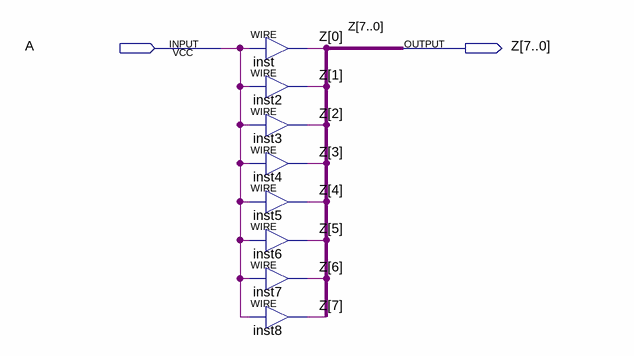
[diagram p0: schematic sheet]
// Quartus schematic replicate.bdf as structural Verilog: 8 symbols, 2 pins
module replicate (
  input  A,
  output [7:0] Z
);

  assign Z[0] = A;  // WIRE inst
  assign Z[1] = A;  // WIRE inst2
  assign Z[2] = A;  // WIRE inst3
  assign Z[3] = A;  // WIRE inst4
  assign Z[4] = A;  // WIRE inst5
  assign Z[5] = A;  // WIRE inst6
  assign Z[6] = A;  // WIRE inst7
  assign Z[7] = A;  // WIRE inst8
endmodule
